# Altium project atWork_Motor_Driver.PrjPcb
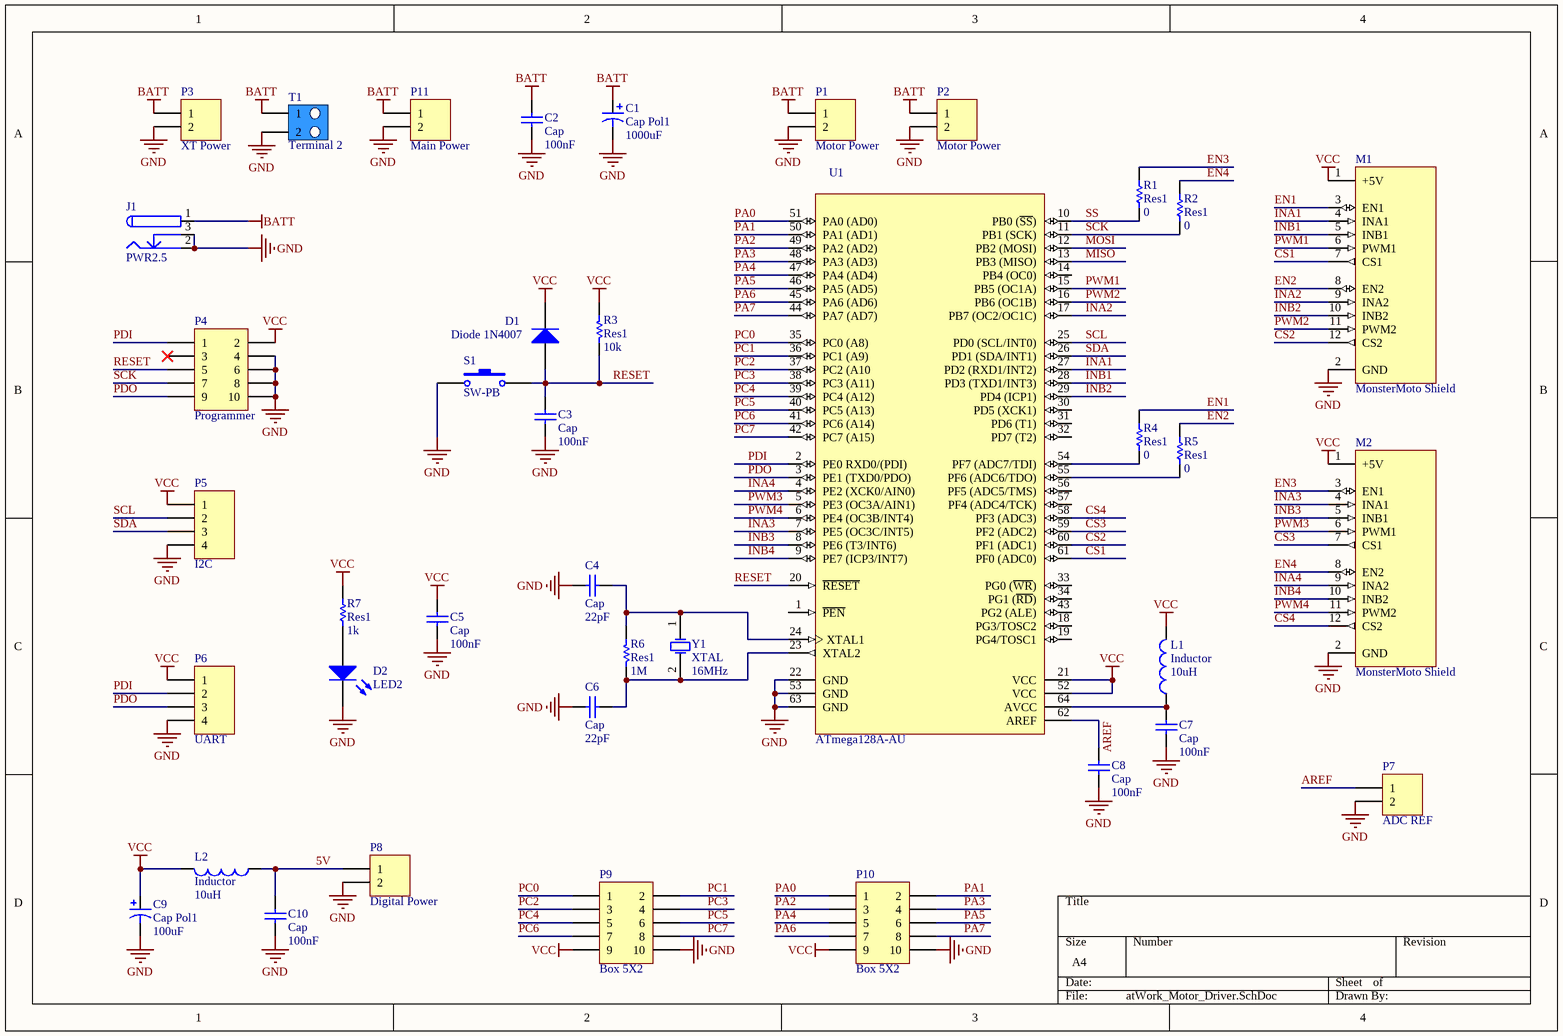
[diagram p0: atWork_Motor_Driver.SchDoc]
1 sheet, 39 parts. Net scope: global (net labels, ports and power ports of the same name join across sheets).
Board file: atWork_Motor_Driver.PcbDoc

## Sheet atWork_Motor_Driver.SchDoc
size A4

### Parts
C1  Cap Pol1  value 1000uF  [CAP2]
C2  Cap  value 100nF  [C1206]
C3  Cap  value 100nF  [C1206]
C4  Cap  value 22pF  [C1206]
C5  Cap  value 100nF  [C1206]
C6  Cap  value 22pF  [C1206]
C7  Cap  value 100nF  [C1206]
C8  Cap  value 100nF  [C1206]
C9  Cap Pol1  value 100uF  [CAP-SMD1]
C10  Cap  value 100nF  [C1206]
D1  Diode 1N4007  [DIODE-SMD]
D2  LED2  [3.2X1.6X1.1]
J1  PWR2.5  [PWR2.5]
L1  Inductor  value 10uH  [C1206]
L2  Inductor  value 10uH  [C1206]
M1  MonsterMoto Shield  [MONSTERMOTO]
M2  MonsterMoto Shield  [MONSTERMOTO]
P1  Motor Power  [POWER2PIN]
P2  Motor Power  [POWER2PIN]
P3  XT Power  [XT]
P4  Programmer  [BOX2X5]
P5  I2C  [XH4PIN]
P6  UART  [XH4PIN]
P7  ADC REF  [XH2PIN]
P8  Digital Power  [XH2PIN]
P9  Box 5X2  [BOX2X5_RIGHT]
P10  Box 5X2  [BOX2X5_RIGHT]
P11  Main Power  [POWER2PIN]
R1  Res1  value 0  [C1206]
R2  Res1  value 0  [C1206]
R3  Res1  value 10k  [C1206]
R4  Res1  value 0  [C1206]
R5  Res1  value 0  [C1206]
R6  Res1  value 1M  [C1206]
R7  Res1  value 1k  [C1206]
S1  SW-PB  [PUSH1]
T1  Terminal 2  [TERMINAL2PIN]
U1  ATmega128A-AU  [64A_M]
Y1  XTAL  value 16MHz  [XTAL]

### Nets
BATT: C1.1 C2.2 J1.1 P1.1 P2.1 P3.1 P11.1 T1.1
GND: C1.2 C2.1 C3.1 C4.1 C5.1 C6.1 C7.1 C8.1 C9.2 C10.1 D2.2(K) J1.2 J1.3 M1.2(GND) M2.2(GND) P1.2 P2.2 P3.2 P4.4 P4.6 P4.8 P4.10 P5.4 P6.4 P7.2 P8.2 P9.10 P10.10 P11.2 S1.2 T1.2 U1.22(GND) U1.53(GND) U1.63(GND)
VCC: C5.2 C9.1 D1.2(K) L1.2 L2.2 M1.1(+5V) M2.1(+5V) P4.2 P5.1 P6.1 P9.9 P10.9 R3.1 R7.2 U1.21(VCC) U1.52(VCC)
5V: C10.2 L2.1 P8.1
AREF: C8.2 P7.1 U1.62(AREF)
CS1: M1.7(CS1) U1.61(PF0_(ADC0))
CS2: M1.12(CS2) U1.60(PF1_(ADC1))
CS3: M2.7(CS1) U1.59(PF2_(ADC2))
CS4: M2.12(CS2) U1.58(PF3_(ADC3))
EN1: M1.3(EN1) R4.2
EN2: M1.8(EN2) R5.2
EN3: M2.3(EN1) R1.2
EN4: M2.8(EN2) R2.2
INA1: M1.4(INA1) U1.27(PD2_(RXD1/INT2))
INA2: M1.9(INA2) U1.17(PB7_(OC2/OC1C))
INA3: M2.4(INA1) U1.7(PE5_(OC3C/INT5))
INA4: M2.9(INA2) U1.4(PE2_(XCK0/AIN0))
INB1: M1.5(INB1) U1.28(PD3_(TXD1/INT3))
INB2: M1.10(INB2) U1.29(PD4_(ICP1))
INB3: M2.5(INB1) U1.8(PE6_(T3/INT6))
INB4: M2.10(INB2) U1.9(PE7_(ICP3/INT7))
MISO: U1.13(PB3_(MISO))
MOSI: U1.12(PB2_(MOSI))
PA0: P10.1 U1.51(PA0_(AD0))
PA1: P10.2 U1.50(PA1_(AD1))
PA2: P10.3 U1.49(PA2_(AD2))
PA3: P10.4 U1.48(PA3_(AD3))
PA4: P10.5 U1.47(PA4_(AD4))
PA5: P10.6 U1.46(PA5_(AD5))
PA6: P10.7 U1.45(PA6_(AD6))
PA7: P10.8 U1.44(PA7_(AD7))
PC0: P9.1 U1.35(PC0_(A8))
PC1: P9.2 U1.36(PC1_(A9))
PC2: P9.3 U1.37(PC2_(A10)
PC3: P9.4 U1.38(PC3_(A11))
PC4: P9.5 U1.39(PC4_(A12))
PC5: P9.6 U1.40(PC5_(A13))
PC6: P9.7 U1.41(PC6_(A14))
PC7: P9.8 U1.42(PC7_(A15))
PDI: P4.1 P6.2 U1.2(PE0_RXD0/(PDI))
PDO: P4.9 P6.3 U1.3(PE1_(TXD0/PDO))
PWM1: M1.6(PWM1) U1.15(PB5_(OC1A))
PWM2: M1.11(PWM2) U1.16(PB6_(OC1B))
PWM3: M2.6(PWM1) U1.5(PE3_(OC3A/AIN1))
PWM4: M2.11(PWM2) U1.6(PE4_(OC3B/INT4))
RESET: C3.2 D1.1(A) P4.5 R3.2 S1.1 U1.20(~{RESET})
SCK: P4.7 R2.1 U1.11(PB1_(SCK))
SCL: P5.2 U1.25(PD0_(SCL/INT0))
SDA: P5.3 U1.26(PD1_(SDA/INT1))
SS: R1.1 U1.10(PB0_(~{SS}))
NetC4_2: C4.2 R6.1 U1.24(XTAL1) Y1.1(OSC1)
NetC6_2: C6.2 R6.2 U1.23(XTAL2) Y1.2(OSC2)
NetC7_2: C7.2 L1.1 U1.64(AVCC)
NetD2_1: D2.1(A) R7.1
NetR4_1: R4.1 U1.54(PF7_(ADC7/TDI))
NetR5_1: R5.1 U1.55(PF6_(ADC6/TDO))

Not connected (* = marked no-connect by the designer): P4 3*; U1 1(~{PEN}) 14(PB4_(OC0)) 18(PG3/TOSC2) 19(PG4/TOSC1) 30(PD5_(XCK1)) 31(PD6_(T1)) 32(PD7_(T2)) 33(PG0_(~{WR})) 34(PG1_(~{RD})) 43(PG2_(ALE)) 56(PF5_(ADC5/TMS)) 57(PF4_(ADC4/TCK))

### Library data of the parts
C1 C9 = Cap Pol1: Polarized Capacitor (Radial); Published: 8-Jun-2000; LatestRevisionDate: 17-Jul-2002; LatestRevisionNote: Re-released for DXP Platform.; PackageReference: RB7.6-15; Publisher: Altium Limited; PackageDescription: Polarized Capacitor (Radial); 2 Leads
C2-C8 C10 = Cap: Capacitor; Published: 8-Jun-2000; LatestRevisionDate: 17-Jul-2002; LatestRevisionNote: Re-released for DXP Platform.; PackageReference: RAD-0.3; Publisher: Altium Limited; PackageDescription: Radial Cap, Thru-Hole; 2 Leads; 0.3 in Pin Spacing
D1 = Diode 1N4007: 1 Amp General Purpose Rectifier; Published: 8-Jun-2000; LatestRevisionDate: 17-Jul-2002; LatestRevisionNote: Re-released for DXP Platform.; DatasheetVersion: 1998; PackageVersion: Aug-1999; PackageReference: DO-41; Publisher: Altium Limited; PackageDescription: Diode, Axial; Body 5.2 x 2.7 mm (LxDia. max), Lead Dia. 0.86 mm (max); Code_JEDEC: DO-204-AL; ComponentLink1Description: Manufacturer Link; ComponentLink1URL: http://www.fairchildsemi.com/; ComponentLink2Description: Datasheet; ComponentLink2URL: http://www.fairchildsemi.com/ds/1N%2F1N4001.pdf
D2 = LED2: Typical RED, GREEN, YELLOW, AMBER GaAs LED; Published: 8-Jun-2000; LatestRevisionDate: 17-Jul-2002; LatestRevisionNote: Re-released for DXP Platform.; PackageVersion: Feb-2002; PackageReference: 3.2X1.6X1.1; Publisher: Altium Limited; PackageDescription: SM LED; 2 Flat Leads
J1 = PWR2.5: Low Voltage Power Supply Connector; Published: 17-Dec-2003; DatasheetDocument: 09-May-2002; Publisher: Altium Limited; ComponentLink1Description: Manufacturer Link; ComponentLink1URL: http://domino.kycon.com/internet/Products.html
L1 L2 = Inductor: Code_IEC: 1005; Published: 8-Jun-2000; LatestRevisionDate: 29-May-2009; LatestRevisionNote: IPC-7351 Footprint Added.; PackageReference: 0402-A; Publisher: Altium Limited; PackageDescription: Chip Inductor; Code_JEITA: 0402
M1 M2 = MonsterMoto: Designer: Meysam Parvizi; Email: meysam.parvizi@live.com; Weblog: http://mp.tabin.ir
P1-P3 P7 P8 P11 = Header 2: Header, 2-Pin; LatestRevisionDate: 17-Jul-2002; LatestRevisionNote: Re-released for DXP Platform.; Publisher: Altium Limited
P4 P9 P10 = Box 5X2: Box, 5-Pin, Dual row; Designer: Meysam Parvizi; Email: meysam.parvizi.ir@gmail.com; Weblog: http://mp.tabin.ir
P5 P6 = Header 4: Header, 4-Pin; LatestRevisionDate: 17-Jul-2002; LatestRevisionNote: Re-released for DXP Platform.; Publisher: Altium Limited
R1-R7 = Res1: Resistor; Published: 8-Jun-2000; LatestRevisionDate: 17-Jul-2002; LatestRevisionNote: Re-released for DXP Platform.; PackageReference: AXIAL-0.3; Publisher: Altium Limited; PackageDescription: Axial Device, Thru-Hole; 2 Leads; 0.3 in Pin Spacing
S1 = SW-PB: Switch; Published: 24-Mar-1999; LatestRevisionDate: 17-Jul-2002; LatestRevisionNote: Re-released for DXP Platform.; PackageReference: SPST-2; Publisher: Altium Limited; PackageDescription: Switch; 2 Leads
T1 = Terminal 2: Terminal, 2 pin; Designer: Meysam Parvizi; Email: meysam.parvizi.ir@gmail.com; Weblog: http://mp.tabin.ir
U1 = ATmega128A-AU: 8-bit AVR Microcontroller, 128KB Flash, 4KB EEPROM, 4KB SRAM, 64-pin TQFP, Industrial Grade (-40°C to 85°C); Published: 1-Apr-2010; DatasheetVersion: revE, Feb-2010; PackageVersion: revB, Oct-2001; PackageReference: 64A; Publisher: Altium Limited; PackageDescription: 64-Pin Plastic Thin Profile Quad Flat Pack, 14 x 14 x 1.0 mm Body, 0.8 mm Pitch (TQFP); Supplier 1: Digi-Key; Supplier Part Number 1: ATMEGA128A-AU-ND; Supplier 2: Farnell; Supplier Part Number 2: 1773397; Supplier 3: Mouser; Supplier Part Number 3: 556-ATMEGA128A-AU; Code_JEDEC: MS-026-AEB; ComponentLink1Description: Manufacturer Link; ComponentLink1URL: http://www.atmel.com/products/avr/default.asp?; ComponentLink2Description: ATmega128A Datasheet; ComponentLink2URL: http://www.atmel.com/dyn/resources/prod_documents/doc8151.pdf; ComponentLink3Description: ATmega128A Summary; ComponentLink3URL: http://www.atmel.com/dyn/resources/prod_documents/8151S.pdf; ComponentLink4Description: Atmel.com Home; ComponentLink4URL: http://www.atmel.com
Y1 = XTAL: Crystal Oscillator; Designer: Meysam Parvizi; Email: meysam.parvizi.ir@gmail.com; Weblog: http://mp.tabin.ir